# Altium schematic sheet Sheet1.SchDoc
size 594 x 420 mm
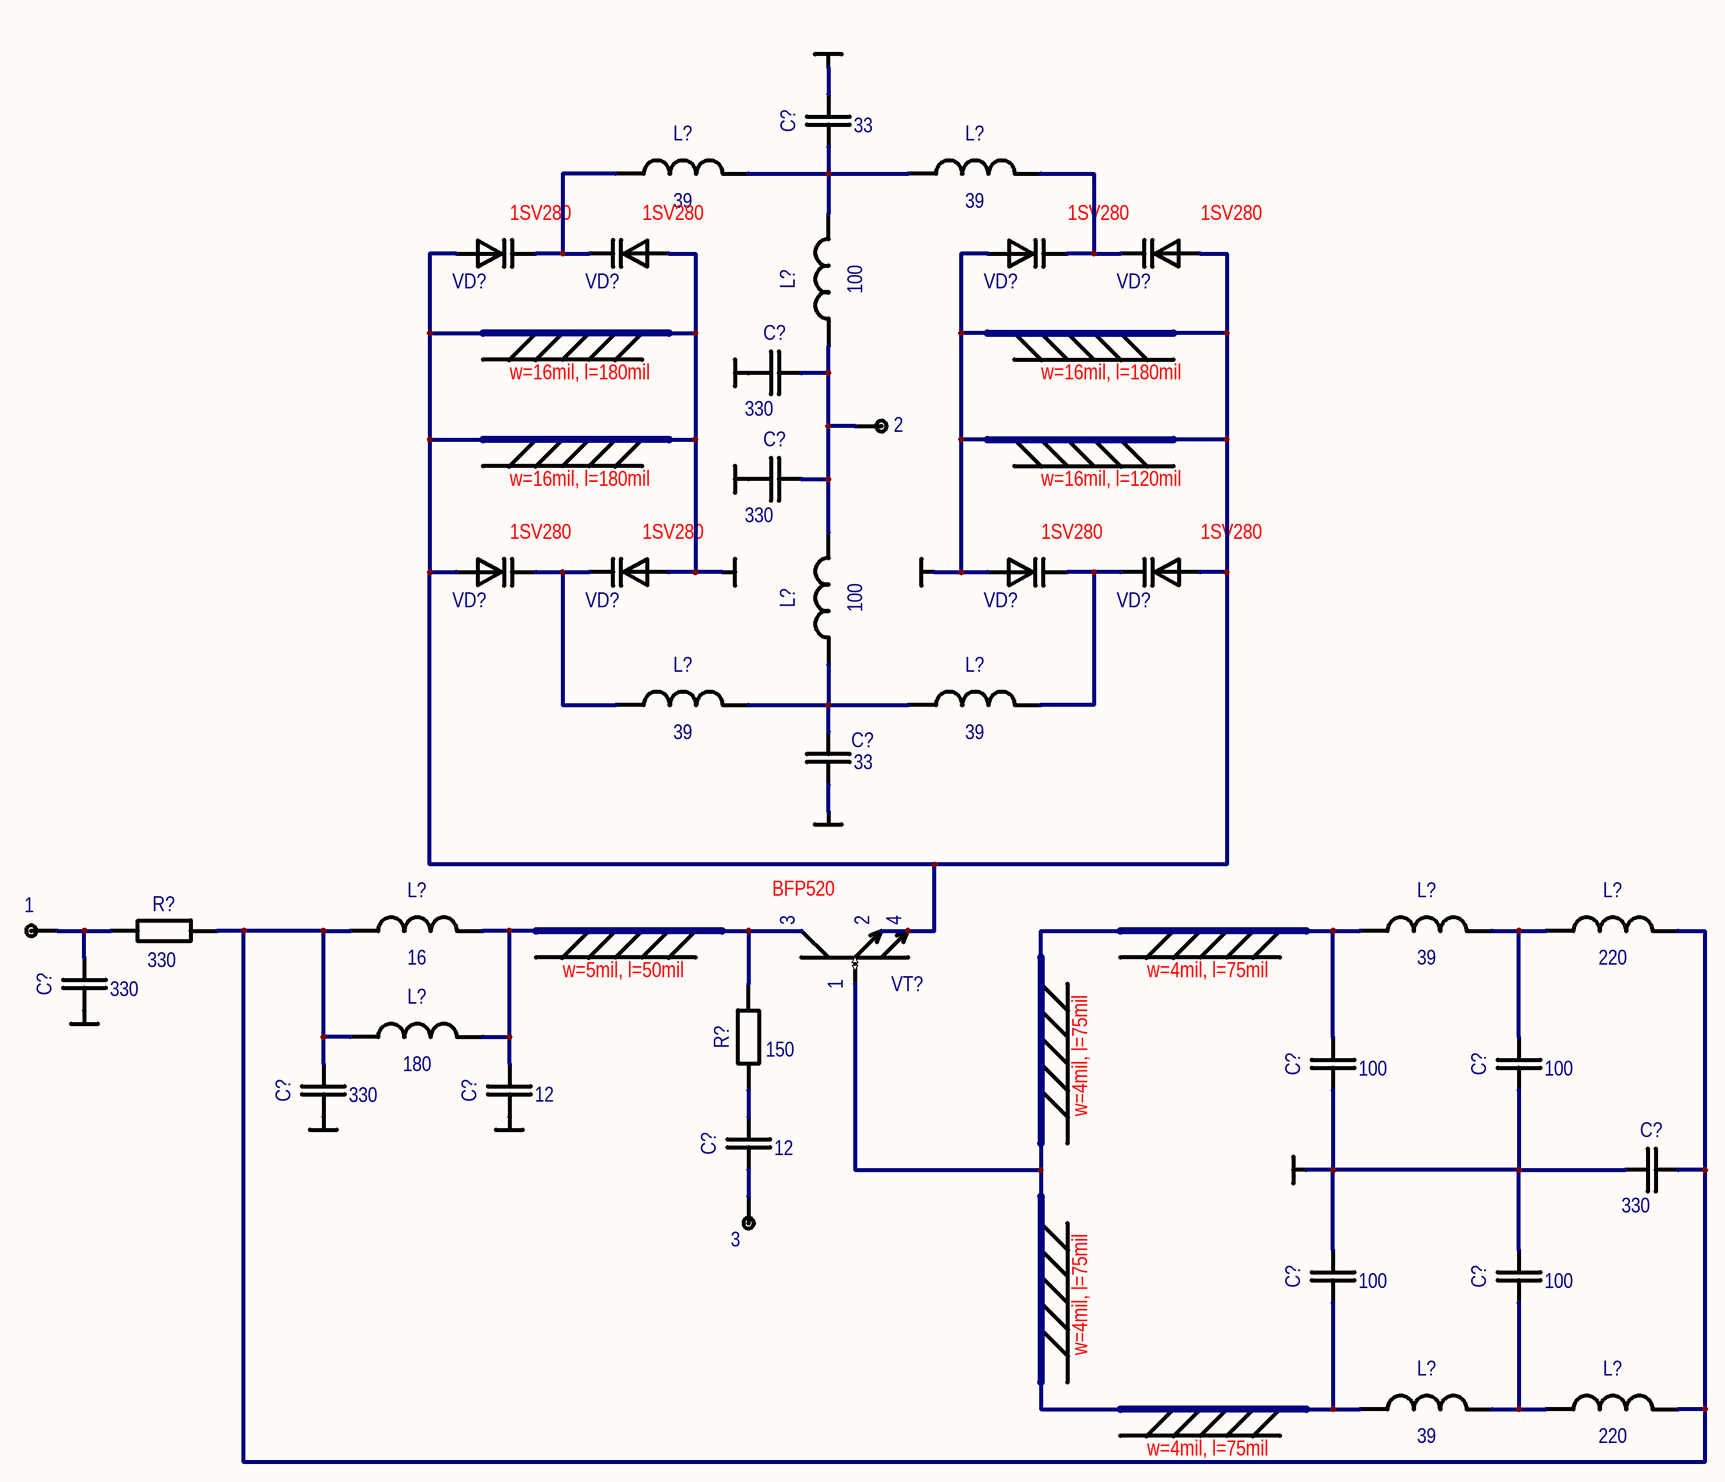
[diagram p0: Sheet1.SchDoc]

## Parts
(Parts that share a designator on the sheet are numbered #1, #2 ... from top to bottom, then left to right.)
1  TP  [TP1]  (value not drawn)  (no BOM)
2  TP  [TP1]  (value not drawn)  (no BOM)
3  TP  [TP1]  (value not drawn)  (no BOM)
*?#1  GND  (value not drawn)  (graphical)
*?#2  GND  (value not drawn)  (graphical)
*?#3  GND  (value not drawn)  (graphical)
*?#4  GND  (value not drawn)  (graphical)
*?#5  GND  (value not drawn)  (graphical)
*?#6  GND  (value not drawn)  (graphical)
*?#7  GND  (value not drawn)  (graphical)
*?#8  GND  (value not drawn)  (graphical)
*?#9  GND  (value not drawn)  (graphical)
*?#10  GND  (value not drawn)  (graphical)
C?#1  33  [CAPC1005L]
C?#2  330  [CAPC1005L]
C?#3  330  [CAPC1005L]
C?#4  33  [CAPC1005L]
C?#5  330  [CAPC1005L]
C?#6  100  [CAPC1005L]
C?#7  100  [CAPC1005L]
C?#8  330  [CAPC1005L]
C?#9  12  [CAPC1005L]
C?#10  12  [CAPC1005L]
C?#11  330  [CAPC1005L]
C?#12  100  [CAPC1005L]
C?#13  100  [CAPC1005L]
L?#1  39  [INDC1608L]
L?#2  39  [INDC1608L]
L?#3  100  [INDC1608L]
L?#4  100  [INDC1608L]
L?#5  39  [INDC1608L]
L?#6  39  [INDC1608L]
L?#7  16  [INDC1107X07N]
L?#8  39  [INDC1608L]
L?#9  220  [INDC2012L]
L?#10  180  [INDC1608L]
L?#11  39  [INDC1608L]
L?#12  220  [INDC2012L]
R?#1  330  [RESC1005L]
R?#2  150  [RESC1608L]
VD?#1  BB149  [SOD2512X100N]  (value not drawn)
VD?#2  BB149  [SOD2512X100N]  (value not drawn)
VD?#3  BB149  [SOD2512X100N]  (value not drawn)
VD?#4  BB149  [SOD2512X100N]  (value not drawn)
VD?#5  BB149  [SOD2512X100N]  (value not drawn)
VD?#6  BB149  [SOD2512X100N]  (value not drawn)
VD?#7  BB149  [SOD2512X100N]  (value not drawn)
VD?#8  BB149  [SOD2512X100N]  (value not drawn)
VT?  (no value)  [SOT130P210X100-4N]

## Nets
GND: C?#1.2 C?#2.1 C?#3.1 C?#4.2 C?#5.1 C?#6.1 C?#7.1 C?#8.1 C?#9.1 C?#11.1 C?#12.2 C?#13.2 VD?#1.2(Anode) VD?#2.2(Anode) VD?#3.2(Anode) VD?#4.2(Anode) VD?#5.2(Anode) VD?#6.2(Anode) VD?#7.2(Anode) VD?#8.2(Anode) VT?.2(Emitter) VT?.4(Emitter)
Net1_1: 1.1 C?#5.2 R?#1.1
Net2_1: 2.1 C?#2.2 C?#3.2 L?#3.1 L?#4.2
Net3_1: 3.1 C?#10.1
NetC?#1_1: C?#1.1 L?#1.2 L?#2.1 L?#3.2
NetC?#4_1: C?#4.1 L?#4.1 L?#5.2 L?#6.1
NetC?#6_2: C?#6.2 C?#12.1 L?#8.1 L?#11.1 VT?.1(Base)
NetC?#7_2: C?#7.2 L?#8.2 L?#9.1
NetC?#8_2: C?#8.2 C?#11.2 L?#7.1 L?#9.2 L?#10.1 L?#12.2 R?#1.2
NetC?#9_2: C?#9.2 L?#7.2 L?#10.2 R?#2.2 VT?.3(Collector)
NetC?#10_2: C?#10.2 R?#2.1
NetC?#13_1: C?#13.1 L?#11.2 L?#12.1
NetL?#1_1: L?#1.1 VD?#1.1(Cathode) VD?#2.1(Cathode)
NetL?#2_2: L?#2.2 VD?#3.1(Cathode) VD?#4.1(Cathode)
NetL?#5_1: L?#5.1 VD?#5.1(Cathode) VD?#6.1(Cathode)
NetL?#6_2: L?#6.2 VD?#7.1(Cathode) VD?#8.1(Cathode)

## Notes on the sheet
- (near VD?#1) 1SV280
- 1SV280
- (near VD?#4) 1SV280
- w=16mil, l=180mil
- w=16mil, l=120mil
- (near VD?#5) 1SV280
- (near VD?#6) 1SV280
- (near VD?#7) 1SV280
- (near VD?#8) 1SV280
- (near VT?) BFP520
- (near R?#2) w=5mil, l=50mil
- w=4mil, l=75mil
- Перв. примен.
- Зам.гл.к.по констр.
- Справ. №
- Нач. подр. выд.ТЗ
- Подп. и дата
- Инв. № дубл.
- СН
- Взам. инв. №
- Изм.
- Лист
- № докум.
- Подп.
- Дата
- Лит.
- Масса
- Масштаб
- Т.контр.
- Пров.
- Разраб.
- Листов
- Нач. КС
- Инв. № подл.
- Н.контр.
- Утв.
- Копировал
- Формат А2

## Library data of the parts
1-3 = TP: Test point
*?#1-*?#10 = GND: Корпус ЕСКД. Для "наложения" на штатный Power Bar
C?#1 C?#4 = i6124B5A08767D000030: Чип-конденсатор; ManufacturerPartNumber: GRM1555C1H330JA01* Murata; Name: 0402; Power/Voltage: 50 В; TKE/TKC: C0G; Tolerance: ±5 %; PCADSymbol: C; PCADLibrary: PASSIV.LIB; BCPId: *; Manufacturer: *; Type: Конденсатор; Value: 33; ImKey: i6124B5A08767D000030; PCADType: C0402; PCADPattern: C0402
C?#2 C?#3 C?#5 C?#8 C?#11 = i6124B5A08767D00004E: Чип-конденсатор; ManufacturerPartNumber: GRM1555C1H331JA01* Murata; Name: 0402; Power/Voltage: 50 В; TKE/TKC: C0G; Tolerance: ±5 %; PCADSymbol: C; PCADLibrary: PASSIV.LIB; BCPId: *; Manufacturer: *; Type: Конденсатор; Value: 330; ImKey: i6124B5A08767D00004E; PCADType: C0402; PCADPattern: C0402
C?#6 C?#7 C?#12 C?#13 = i6124B5A08767D000072: Чип-конденсатор; ManufacturerPartNumber: GCM1555C1H101JA16* Murata; Name: 0402; Power/Voltage: 50 В; TKE/TKC: C0G; Tolerance: ±5 %; PCADSymbol: C; PCADLibrary: PASSIV.LIB; BCPId: *; Manufacturer: *; Type: Конденсатор; Value: 100; ImKey: i6124B5A08767D000072; PCADType: C0402; PCADPattern: C0402
C?#9 C?#10 = i6124B5A08767D00007A: Чип-конденсатор; ManufacturerPartNumber: GCM1555C1H120JA16* Murata; Name: 0402; Power/Voltage: 50 В; TKE/TKC: C0G; Tolerance: ±5 %; PCADSymbol: C; PCADLibrary: PASSIV.LIB; BCPId: *; Manufacturer: *; Type: Конденсатор; Value: 12; ImKey: i6124B5A08767D00007A; PCADType: C0402; PCADPattern: C0402
L?#1 L?#2 L?#5 L?#6 L?#8 L?#11 = i6124B5A0876B600001B: Индуктивность без магнитопровода; ManufacturerPartNumber: 0603CS-39NXJE* Coilcraft; Name: 0603; Tolerance: ±5 %; PCADType: L-0603; PCADSymbol: INDUCT; PCADPattern: L0603M; PCADLibrary: PASSIV.LIB; BCPId: *; Manufacturer: *; Package: *; Type: Индуктивность; Value: 39; ImKey: i6124B5A0876B600001B
L?#3 L?#4 = i6124B5A08A50900001A: Индуктивность без магнитопровода; ManufacturerPartNumber: LQG18HNR10J00* Murata; Name: 0603; Tolerance: ±5 %; PCADType: LQG18H; PCADSymbol: INDUCT; PCADLibrary: PASSIV.LIB; BCPId: *; Manufacturer: *; Package: *; Type: Индуктивность; Value: 100; ImKey: i6124B5A08A50900001A; PCADPattern: LQG18H
L?#7 = i6124B5A0876BE00000C: Индуктивность без магнитопровода; ManufacturerPartNumber: 0402DC-16NXJR* Coilcraft; Name: 0402DC; Tolerance: ±5 %; PCADType: L-0402; PCADSymbol: INDUCT; PCADPattern: L0402M; PCADLibrary: PASSIV.LIB; BCPId: *; Manufacturer: *; Package: *; Type: Индуктивность; Value: 16; ImKey: i6124B5A0876BE00000C
L?#9 L?#12 = i6124B5A0876B8000012: Индуктивность без магнитопровода; ManufacturerPartNumber: 0805CS-221XJE* Coilcraft; Name: 0805; Tolerance: ±5 %; PCADType: L-0805; PCADSymbol: DROSSEL FERROMAGNETIC; PCADPattern: 0805PS; PCADLibrary: PASSIV.LIB; BCPId: *; Manufacturer: *; Package: *; Type: Индуктивность; Value: 220; ImKey: i6124B5A0876B8000012
L?#10 = i6124B5A0876B6000015: Индуктивность без магнитопровода; ManufacturerPartNumber: 0603CS-R18XJE* Coilcraft; Name: 0603; Tolerance: ±5 %; PCADType: L-0603; PCADSymbol: INDUCT; PCADPattern: L0603M; PCADLibrary: PASSIV.LIB; BCPId: *; Manufacturer: *; Package: *; Type: Индуктивность; Value: 180; ImKey: i6124B5A0876B6000015
R?#1 = i6124B5A0876CB00001D: Чип-резистор; ManufacturerPartNumber: CR0402-JW-331GLF Bourns; Name: 0402; Tolerance: ±5 %; PCADSymbol: R; PCADLibrary: PASSIV.LIB; BCPId: *; Manufacturer: *; Type: Резистор; Value: 330; ImKey: i6124B5A0876CB00001D; PCADType: R0402; PCADPattern: R0402
R?#2 = i6124B5A0876CD00003F: Чип-резистор; ManufacturerPartNumber: CR0603-JW-151ELF Bourns; Name: 0603; Tolerance: ±5 %; PCADSymbol: R; PCADLibrary: PASSIV.LIB; BCPId: *; Manufacturer: *; Type: Резистор; Value: 150; ImKey: i6124B5A0876CD00003F; PCADType: R0603; PCADPattern: R0603
VD?#1-VD?#8 = BB149: UHF variable capacitance diode; Manufacturer: NXP; ManufacturerPartNumber: BB149A; Type: Диод; SymAuthor: Юдин Д.Г.; BCPId: *; Name: *; Package: SC-76 (SOD323)
VT? = BFP540: Low Noise Silicon Bipolar RF Transistor; Manufacturer: Infineon; Type: Транзистор; BCPId: *; ManufacturerPartNumber: BFP540; Package: SOT343